# Altium schematic sheet LIDO-HW.100.Page_6.SchDoc
size A3; SheetNumber: 10; SheetTotal: 14
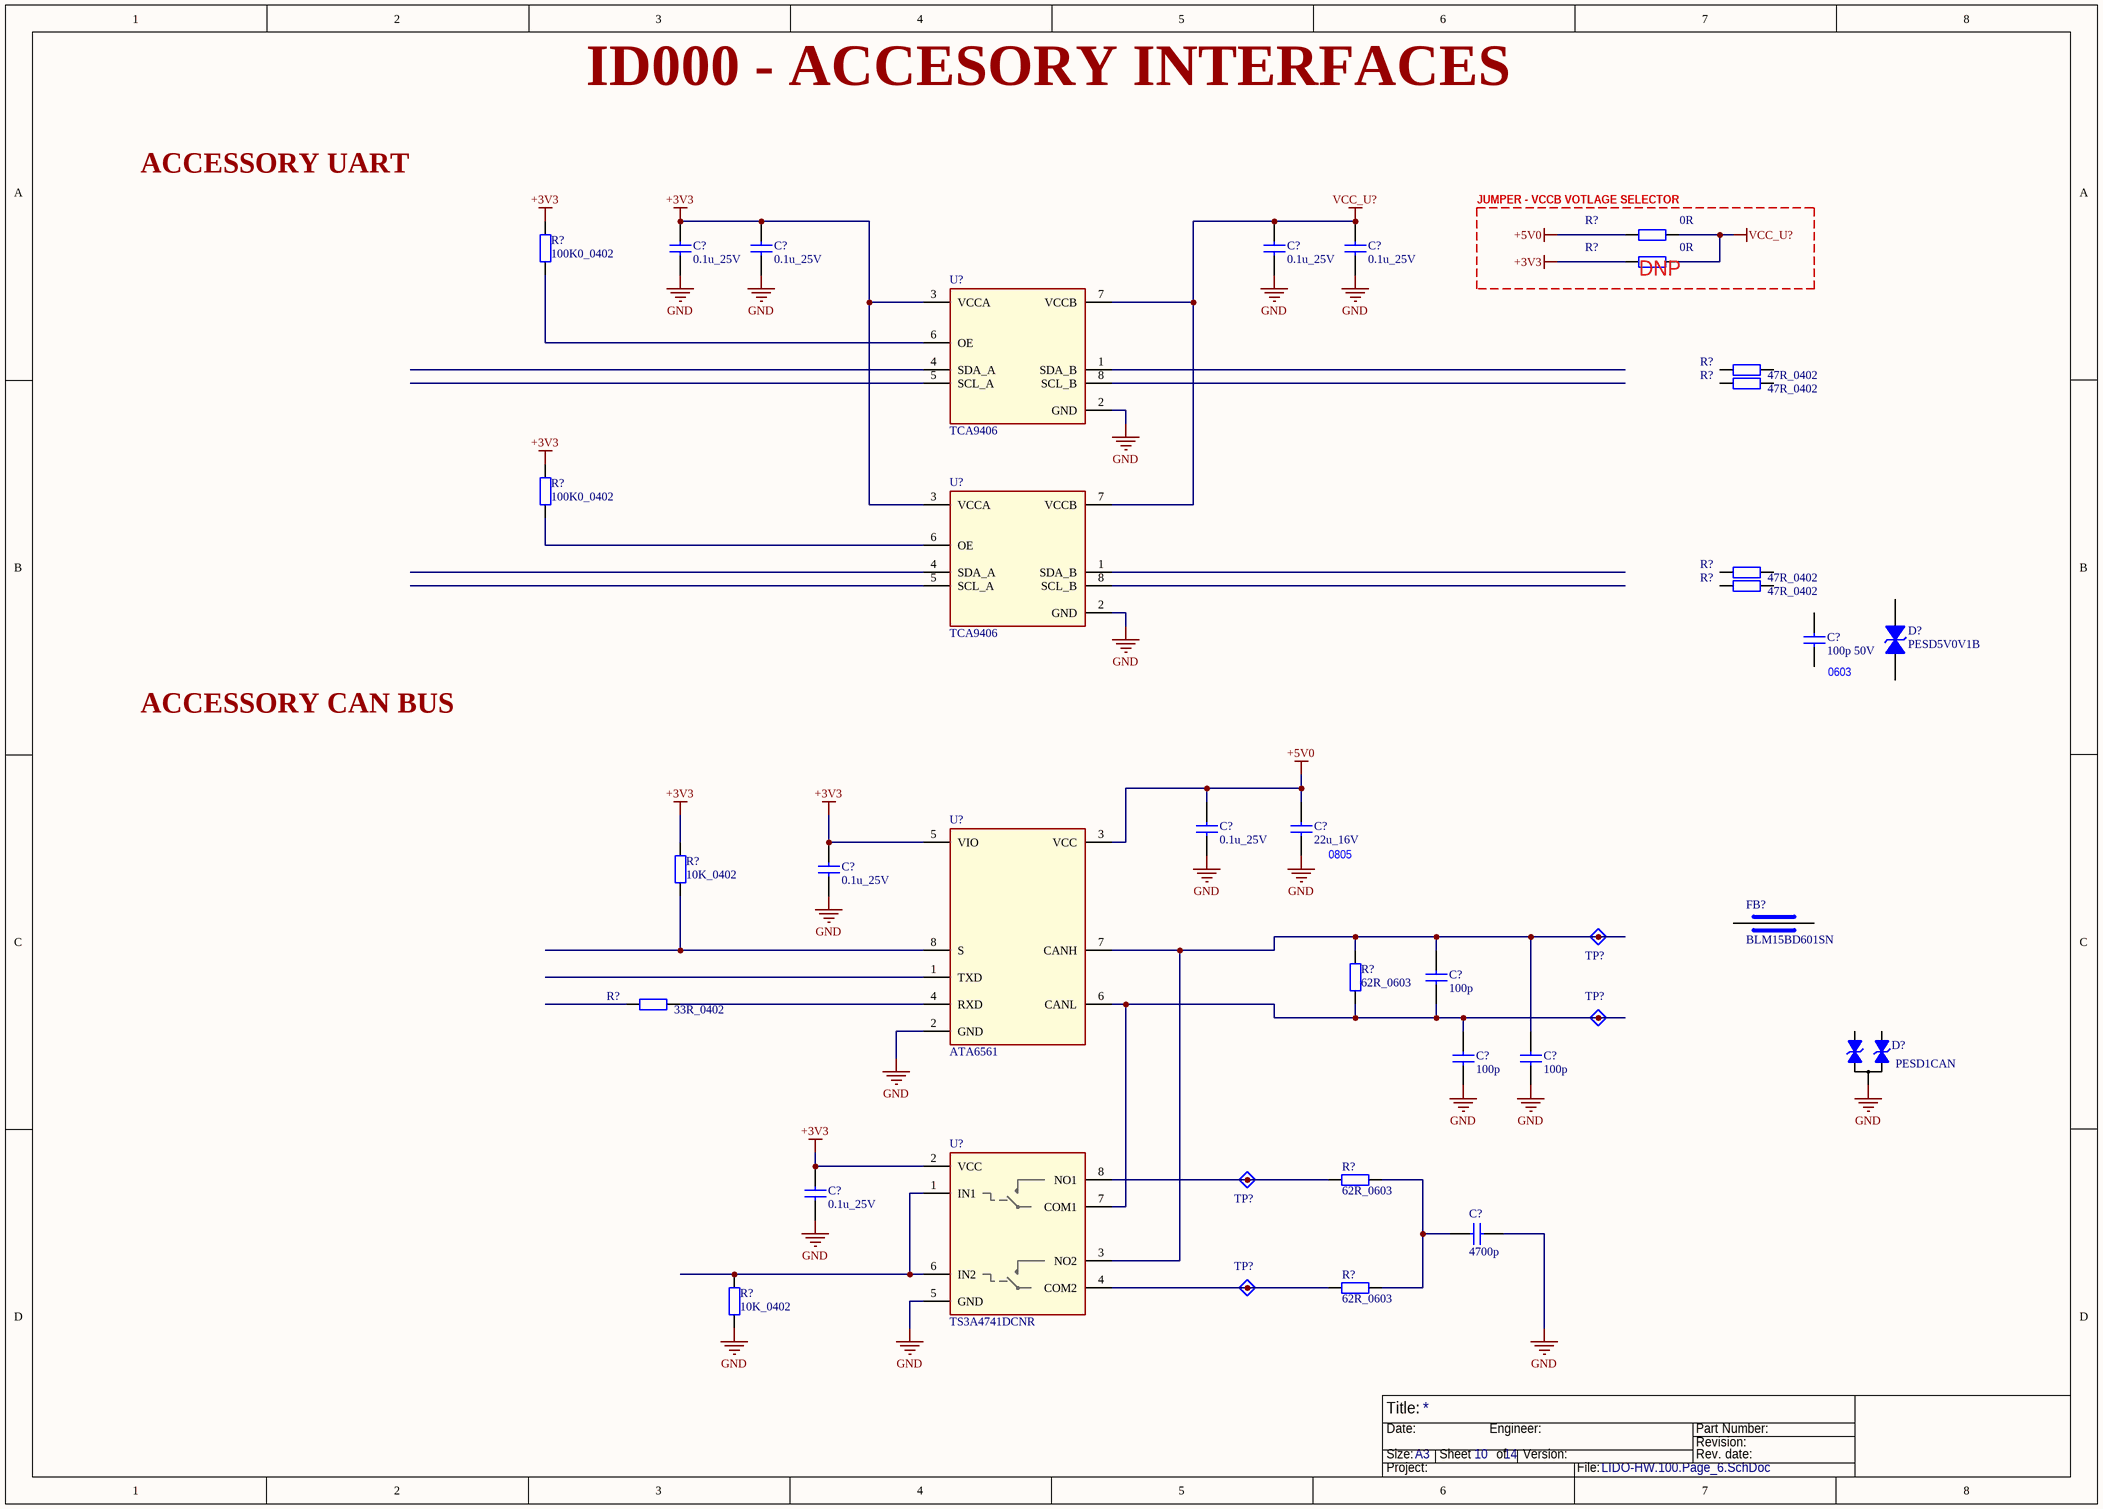
[diagram p0: LIDO-HW.100.Page_6.SchDoc]

## Parts
(Parts that share a designator on the sheet are numbered #1, #2 ... from top to bottom, then left to right.)
C?#1  0.1u_25V
C?#2  0.1u_25V
C?#3  0.1u_25V
C?#4  0.1u_25V
C?#5  100p 50V
C?#6  0.1u_25V
C?#7  22u_16V
C?#8  0.1u_25V
C?#9  100p
C?#10  100p
C?#11  100p
C?#12  0.1u_25V
C?#13  4700p
D?#1  PESD5V0V1B
D?#2  PESD1CAN
FB?  BLM15BD601SN
R?#1  0R
R?#2  100K0_0402
R?#3  0R
R?#4  47R_0402
R?#5  47R_0402
R?#6  100K0_0402
R?#7  47R_0402
R?#8  47R_0402
R?#9  10K_0402
R?#10  62R_0603
R?#11  33R_0402
R?#12  62R_0603
R?#13  62R_0603
R?#14  10K_0402
TP?#1  TestPoint_A  (value not drawn)  (no BOM)
TP?#2  TestPoint_A  (value not drawn)  (no BOM)
TP?#3  TestPoint_A  (value not drawn)  (no BOM)
TP?#4  TestPoint_A  (value not drawn)  (no BOM)
U?#1  TCA9406
U?#2  TCA9406
U?#3  ATA6561  [SOIC8P127_490X600X175L83X42N]
U?#4  TS3A4741DCNR  [TSOP65P280X145-8N]

## Blocks framed on the sheet
DNP: R?#1 R?#3

## Nets
+3V3: C?#1.1 C?#2.1 C?#8.1 C?#12.1 R?#2.1 R?#3.1 R?#6.1 R?#9.1 U?#1.3(VCCA) U?#2.3(VCCA) U?#3.5(VIO) U?#4.2(VCC)
+5V0: C?#6.1 C?#7.1 R?#1.1 U?#3.3(VCC)
GND: C?#1.2 C?#2.2 C?#3.2 C?#4.2 C?#6.2 C?#7.2 C?#8.2 C?#10.2 C?#11.1 C?#12.2 C?#13.2 D?#2.3 R?#14.2 U?#1.2(GND) U?#2.2(GND) U?#3.2(GND) U?#4.5(GND)
VCC_U?: C?#3.1 C?#4.1 R?#1.2 R?#3.2 U?#1.7(VCCB) U?#2.7(VCCB)
NetC?#9_1: C?#9.1 C?#11.2 R?#10.1 TP?#1.1(TP) U?#3.7(CANH) U?#4.3(NO2)
NetC?#9_2: C?#9.2 C?#10.1 R?#10.2 TP?#2.1(TP) U?#3.6(CANL) U?#4.7(COM1)
NetC?#13_1: C?#13.1 R?#12.1 R?#13.1
NetR?#2_2: R?#2.2 U?#1.6(OE)
NetR?#6_2: R?#6.2 U?#2.6(OE)
NetR?#9_2: R?#9.2 U?#3.8(S)
NetR?#11_1: R?#11.1 U?#3.4(RXD)
NetR?#12_2: R?#12.2 TP?#3.1(TP) U?#4.8(NO1)
NetR?#13_2: R?#13.2 TP?#4.1(TP) U?#4.4(COM2)
NetR?#14_1: R?#14.1 U?#4.1(IN1) U?#4.6(IN2)

Not connected (* = marked no-connect by the designer): C?#5 1 2; D?#1 A C; D?#2 1 2; FB? 1 2; R?#4 1 2; R?#5 1 2; R?#7 1 2; R?#8 1 2; R?#11 2; U?#1 1(SDA_B) 4(SDA_A) 5(SCL_A) 8(SCL_B); U?#2 1(SDA_B) 4(SDA_A) 5(SCL_A) 8(SCL_B); U?#3 1(TXD)

## Notes on the sheet
- ID000 - ACCESORY INTERFACES
- ACCESSORY UART
- (near R?#1) JUMPER - VCCB VOTLAGE SELECTOR
- ACCESSORY CAN BUS
- (near C?#5) 0603
- (near C?#7) 0805
- Title:
- Size:
- Date:
- A3
- Sheet       of
- Engineer:
- Version:
- Part Number:
- Revision:
- Rev. date:
- Project:
- File:

## Library data of the parts
C?#1-C?#13 = Ceramic: Ceramic CAP Symbol
D?#1 = BI-TVS_DIODE_B: Bidirectional TVS Diode Symbol
D?#2 = Double Bi-TVS_B: Double bidirectional ESD protection diodes
FB? = FERRITE_BEAD: Ferrite Bead Symbol
R?#1-R?#14 = Resistor: Resistor Symbol
TP?#1-TP?#4 = TestPoint_A: Test Point Symbol verion A; 00_Name: TP_XXmm; 01_Diameter: 1mm; 02_Layer: *
U?#1 U?#2 = TCA9406_A: 2-Bit Bidirectional 1-MHz, I / 2C Bus and SMBus Voltage-Level Translator With 8-kV HBM ESD
U?#3 = ATA6561_A: IC TRANSCEIVER 1/1 8SO; Manufacturer: Microchip Technology; Manufacturer Part Number: ATA6561-GAQW; Designer: Matt Drazenovich; Ratings: RoHS; Reviewed: Dekimo_07-07-2020; Case/Package: 8-SOIC; ComponentType: IC; Design Date: 22-11-2019; Max Operating Temperature: 150°C; Min Operating Temperature: -40°C; Value: ATA6561
U?#4 = TS3A4741D_A: 2 Circuit IC Switch 1:1 900mOhm SOT-23-8; Manufacturer: Texas Instruments; Designer: Matt Drazenovich; Ratings: RoHS; Reviewed: Not Footprint; Case/Package: SOT-23-8; ComponentType: IC; Design Date: 09-09-2021; Manufacturer Part Number: TS3A4741DCNR; Max Operating Temperature: 85°C; Min Operating Temperature: -40°C; Value: TS3A4741DCNR